# Altium schematic sheet IMU.SchDoc
size A; SheetNumber: 2; SheetTotal: 3
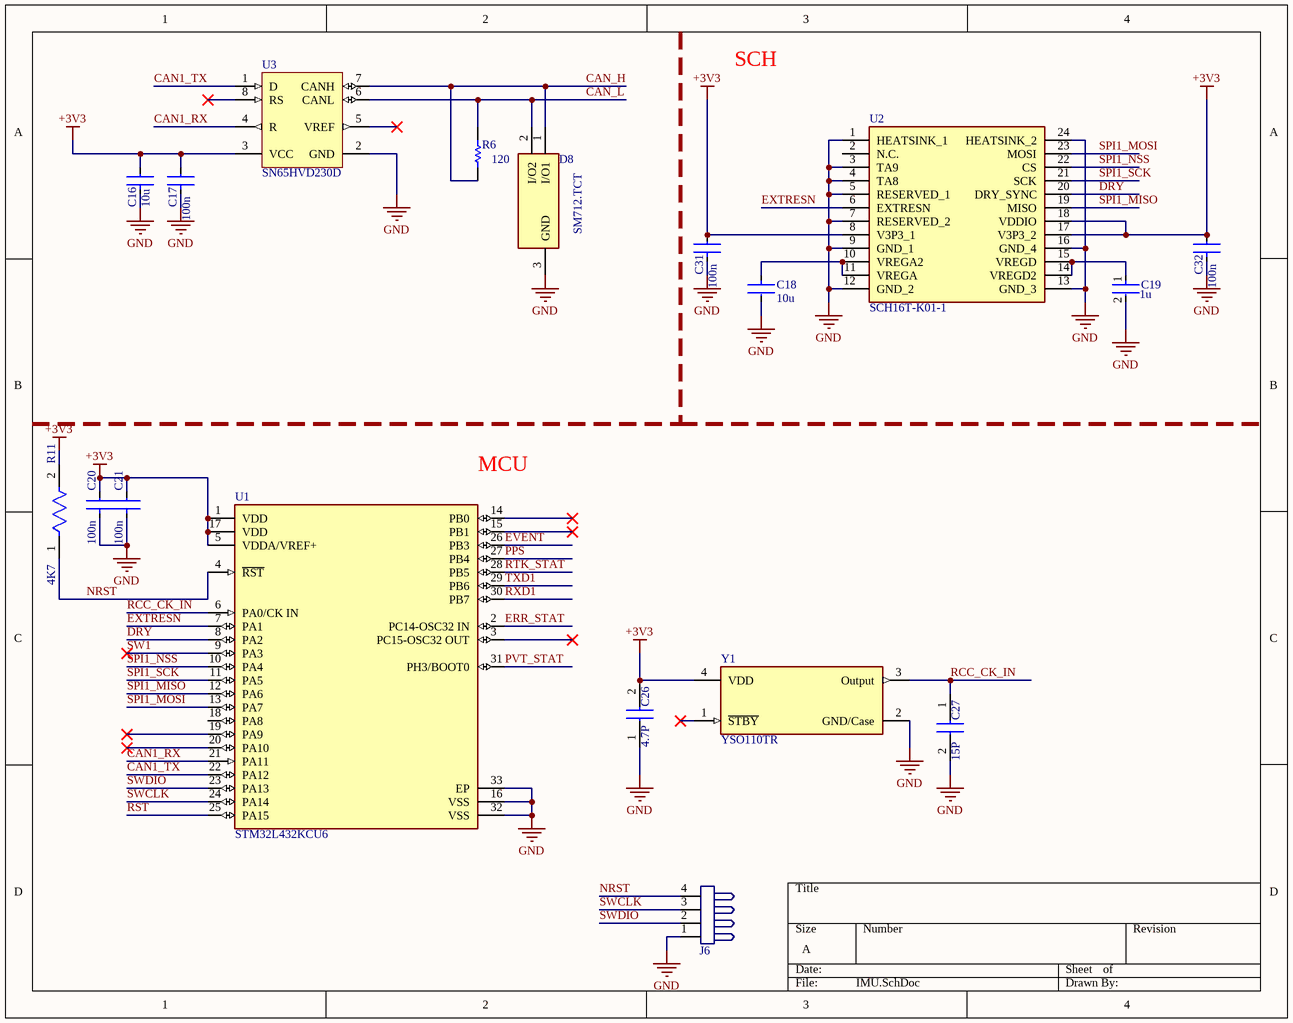
[diagram p0: IMU.SchDoc]

## Parts
C16  value 10u  [FP-C1608-080-IPC_A]  (hidden comment: C1608X5R1E106M080AC)
C17  value 100n  [FP-C1005-050-0_05-IPC_C]  (hidden comment: C1005X7R1H104K050BB)
C18  value 10u  [FP-C1608-080-IPC_A]  (hidden comment: C1608X5R1E106M080AC)
C19  Capacitance: 1u  [FP-C1005-050-0_05-IPC_C]  (hidden comment: C1005X5R1V105K050BC)
C20  value 100n  [FP-C1005-050-0_05-IPC_C]  (hidden comment: C1005X7R1H104K050BB)
C21  value 100n  [FP-C1005-050-0_05-IPC_C]  (hidden comment: C1005X7R1H104K050BB)
C26  value 4.7P  [CAPC1005X55N]  (hidden comment: CC0402BRNPO9BN4R7)
C27  value 15P  [CAPC1005X55N]  (hidden comment: CC0402JRNPO8BN150)
C31  value 100n  [FP-C1005-050-0_05-IPC_C]  (hidden comment: C1005X7R1H104K050BB)
C32  value 100n  [FP-C1005-050-0_05-IPC_C]  (hidden comment: C1005X7R1H104K050BB)
D8  SM712.TCT  [SOT95P237X112-3N]
J6  PHDR 4  [PHDR2X2]  (value not drawn)
R6  value 120  [RESC1005X40X25NL05T10]  (hidden comment: RC0402FR-07120RL)
R11  value 4K7  [FP-RC0402-0_4-MFG]  (hidden comment: RC0402JR-074K7L)
U1  STM32L432KCU6  [FP-UFQFPN32-A0B8-MFG]
U2  SCH16T-K01-1  [SCH16TK011]
U3  SN65HVD230D  [D0008A_M]
Y1  YSO110TR  [FP-ASE-MFG]

## Nets
+3V3: C16.2 C17.2 C20.2 C21.2 C26.2 C31.2 C32.2 R11.2 U1.1(VDD) U1.5(VDDA/VREF+) U1.17(VDD) U2.8(V3P3_1) U2.17(V3P3_2) U2.18(VDDIO) U3.3(VCC) Y1.4(VDD)
GND: C16.1 C17.1 C18.2 C19.2 C20.1 C21.1 C26.1 C27.2 C31.1 C32.1 D8.3(GND) J6.1 U1.16(VSS) U1.32(VSS) U1.33(EP) U2.1(HEATSINK_1) U2.3(TA9) U2.4(TA8) U2.5(RESERVED_1) U2.7(RESERVED_2) U2.9(GND_1) U2.12(GND_2) U2.13(GND_3) U2.16(GND_4) U2.24(HEATSINK_2) U3.2(GND) Y1.2(GND/Case)
CAN1_RX: U1.21(PA11) U3.4(R)
CAN1_TX: U1.22(PA12) U3.1(D)
CAN_H: D8.1(I/O1) R6.1 U3.7(CANH)
CAN_L: D8.2(I/O2) R6.2 U3.6(CANL)
DRY: U1.8(PA2) U2.20(DRY_SYNC)
ERR_STAT: U1.2(PC14-OSC32_IN)
EVENT: U1.26(PB3)
EXTRESN: U1.7(PA1) U2.6(EXTRESN)
NRST: J6.4 R11.1 U1.4(~{RST})
PPS: U1.27(PB4)
PVT_STAT: U1.31(PH3/BOOT0)
RCC_CK_IN: C27.1 U1.6(PA0/CK_IN) Y1.3(Output)
RST: U1.25(PA15)
RTK_STAT: U1.28(PB5)
RXD1: U1.30(PB7)
SPI1_MISO: U1.12(PA6) U2.19(MISO)
SPI1_MOSI: U1.13(PA7) U2.23(MOSI)
SPI1_NSS: U1.10(PA4) U2.22(CS)
SPI1_SCK: U1.11(PA5) U2.21(SCK)
SW1: U1.9(PA3)
SWCLK: J6.3 U1.24(PA14)
SWDIO: J6.2 U1.23(PA13)
TXD1: U1.29(PB6)
NetC18_1: C18.1 U2.10(VREGA2) U2.11(VREGA)
NetC19_1: C19.1 U2.14(VREGD2) U2.15(VREGD)

Not connected (* = marked no-connect by the designer): U1 3(PC15-OSC32_OUT)* 14(PB0)* 15(PB1)* 18(PA8) 19(PA9)* 20(PA10)*; U2 2(N.C.); U3 5(VREF)* 8(RS)*; Y1 1(~{STBY})*

## Notes on the sheet
- SCH
- (near U1) MCU

## Library data of the parts
C16 C18 = CMP-2000-05442-2: CAP CER 10UF 25V X5R 0603; Dielectric Material: Ceramic; Tolerance: 20%; Dielectric: X5R; Length: 1.6mm; Termination: SMD/SMT; Depth: 0.8mm; RoHS Compliant: Yes; Construction: Flat; Weight: 7.1E-05oz; Thickness: 0.039inch; Packaging: Tape and Reel; Min Operating Temperature: -55°C; Case Code (Imperial): 0603; Case/Package: 0603; Height: 0.8mm; Case Code (Metric): 1608; Voltage Rating: 25V; Resistor Type: Ceramic; Voltage Rating (DC): 25V; Max Operating Temperature: 85°C; REACH SVHC: No SVHC; Lead Free: Lead Free; Series: C; Width: 0.8mm; Mount: Surface Mount; Package Quantity: 1; Capacitance: 10uF
C17 C20 C21 C31 C32 = CMP-2000-05393-2: Multilayer Ceramic Capacitors 100nF ±10% 50V X7R SMD 0402; Voltage: 50V; Dielectric Material: Ceramic; Min Operating Temperature: -55°C; Depth: 0.5mm; Radiation Hardening: No; RoHS Compliant: Yes; Voltage Rating (DC): 50V; Lead Free: Lead Free; Resistor Type: Ceramic; Height: 0.5mm; Dielectric: X7R; Thickness: 0.022inch; Case/Package: 0402; Case Code (Metric): 1005; Termination: SMD/SMT; Capacitance: 100nF; Packaging: Tape and Reel; Max Operating Temperature: 125°C; Mount: Surface Mount; Package Quantity: 1; Width: 0.02inch; Weight: 2.3E-05oz; Voltage Rating: 50V; Tolerance: 10%; Construction: Flat; Case Code (Imperial): 0402; Length: 1mm; REACH SVHC: No SVHC; Series: C
C19 = CMP-2000-06004-2: Multilayer Ceramic Capacitors 1μF ±10% 35V X5R SMD 0402; Series: C; Voltage Rating (DC): 35V; Max Operating Temperature: 85°C; Resistor Type: Ceramic; REACH SVHC: No SVHC; Package Quantity: 1; Packaging: Tape and Reel; Termination: SMD/SMT; Dielectric Material: Ceramic; Height: 0.5mm; Length: 1mm; Min Operating Temperature: -55°C; Dielectric: X5R; Thickness: 0.022inch; Lead Free: Lead Free; Voltage Rating: 35V; Width: 0.02inch; Depth: 0.5mm; Case Code (Imperial): 0402; Case/Package: 0402; Tolerance: 10%; Weight: 2.3E-05oz; Radiation Hardening: No; RoHS Compliant: Yes; Case Code (Metric): 1005; Mount: Surface Mount
C26 = CC0402BRNPO9BN4R7: Capacitor; Manufacturer_Name: KEMET; Datasheet Link: https://4donline.ihs.com/images/VipMasterIC/IC/YAGO/YAGO-S-A0009251638/YAGO-S-A0009251638-1.pdf?hkey=6D3A4C79FDBF58556ACFDE234799DDF0; Height: 0.55mm; Manufacturer_Part_Number: CC0402BRNPO9BN4R7; Mouser Part Number: 603-CC402BRNPO9BN4R7; Mouser Price/Stock: https://www.mouser.co.uk/ProductDetail/Yageo/CC0402BRNPO9BN4R7?qs=AgBp2OyFlx%2FGrCNlQaiLcg%3D%3D; Arrow Part Number: CC0402BRNPO9BN4R7; Arrow Price/Stock: https://www.arrow.com/en/products/cc0402brnpo9bn4r7/yageo
C27 = CC0402JRNPO8BN150: Capacitor; Manufacturer_Name: KEMET; Datasheet Link: https://www.mouser.com/datasheet/2/447/UPY-GP_NP0_16V-to-50V_16-1109089.pdf; Height: 0.55mm; Manufacturer_Part_Number: CC0402JRNPO8BN150; Mouser Part Number: 603-CC402JRNPO8BN150; Mouser Price/Stock: https://www.mouser.com/Search/Refine.aspx?Keyword=603-CC402JRNPO8BN150; Arrow Part Number: CC0402JRNPO8BN150; Arrow Price/Stock: https://www.arrow.com/en/products/cc0402jrnpo8bn150/yageo
D8 = SM712.TCT: Diode; Manufacturer_Name: SEMTECH; Datasheet Link: https://datasheet.datasheetarchive.com/originals/distributors/Datasheets-30/DSA-588511.pdf; Height: 1.12mm; Manufacturer_Part_Number: SM712.TCT; Mouser Part Number: 947-SM712.TCT; Mouser Price/Stock: https://www.mouser.co.uk/ProductDetail/Semtech/SM712.TCT?qs=rBWM4%252BvDhIfYU4k7Soov1w%3D%3D; Arrow Part Number: SM712.TCT; Arrow Price/Stock: https://www.arrow.com/en/products/sm712.tct/semtech?utm_currency=USD&region=nac
J6 = PHDR 4: PinHeader
R6 = CMP-2002-07370-1: Manufacturer: Yageo / Phycomp; Part Number: RC0402FR-07120RL
R11 = CMP-2002-08011-2: Tolerance: 5%; Power Rating: 63mW; Voltage Rating: 50V; Temperature Coefficient: 100ppm/°C; Composition: Thick Film; Max Operating Temperature: 155°C; Case/Package: 0402; Depth: 500µm; Packaging: Tape & Reel; Number of Pins: 2; Schedule B: 8533210045, 8533210045; Case Code (Imperial): 0402; Termination: SMD/SMT; Military Standard: Not; Lead Free: Lead Free; Width: 500µm; REACH SVHC: No SVHC; Max Power Dissipation: 63mW; Voltage Rating (AC): 50V; Features: Moisture Resistant; Min Operating Temperature: -55°C; Number of Terminations: 2; RoHS: Compliant; Height: 350µm; Voltage Rating (DC): 50V; Length: 1mm
U1 = CMP-12105-000033-1: IC MCU 32BIT 256KB FLASH 32QFPN; Manufacturer: STMicroelectronics; Max Supply Voltage: 3.6V; Number Of Timers/Counters: 11; Ram Size: 64KBytes; Number Of Usb Channels: 1; Memory Size: 256KBytes; Number Of Uart Channels: 3; Frequency: 80MHz; Number Of I2C Channels: 2; Core Architecture: ARM Cortex-M4; Number Of I/Os: 26; Min Supply Voltage: 1.62V; Data Bus Width: 32bits; Max Junction Temp: +105°C; Interface: I2C,SPI,UART,USART,CAN,USB,LIN,IrDA,Other; Ambient Temperature Range High: +85°C; Category: IC; Device Class L2: Embedded Processors and Controllers; Ambient Temperature Range Low: -40°C; Number Of Adc Channels: 11; ComponentLink2Description: Datasheet; Number Of A/D Converters: 1; Device Class L1: Integrated Circuits (ICs); Memory Type: FLASH; Height: 0.6mm; Temperature: -40°C to +105°C; Automotive: No; Temperature Range Low: -40°C; Digikey Description: IC MCU 32BIT 256KB FLASH 32QFPN; Manufacturer Part Number: STM32L432KCU6; Temperature Range High: +105°C; Octopart: https://octopart.com/stm32l432kcu6-stmicroelectronics-71093510; Device Class L3: Microcontrollers; Number Of Pwm Channels: 1; Number Of Spi Channels: 2; Lead Free: Yes; Number Of Cores: 1; Package: UFQFPN32-A0B8; ComponentLink2URL: https://www.st.com/content/ccc/resource/technical/document/datasheet/24/01/9f/59/f0/83/47/fc/DM00257205.pdf/files/DM00257205.pdf/jcr:content/translations/en.DM00257205.pdf; RoHS: TRUE
U2 = SCH16T-K01-1: Undefined or Miscellaneous; Manufacturer_Name: Murata Electronics; Datasheet Link: https://www.murata.com/-/media/webrenewal/products/sensor/pdf/datasheet/datasheet-sch16t-series-short.ashx?la=en-us&cvid=20240110024121000000; Height: 3mm; Manufacturer_Part_Number: SCH16T-K01-1; Mouser Part Number: 81-SCH16T-K01-1; Mouser Price/Stock: https://www.mouser.co.uk/ProductDetail/Murata-Electronics/SCH16T-K01-1?qs=HFfMDpzxxd0hctvcENbFhg%3D%3D; Arrow Part Number: SCH16T-K01-1; Arrow Price/Stock: https://www.arrow.com/en/products/sch16t-k01-1/murata-manufacturing?utm_currency=USD&region=nac
U3 = CMP-0315-00046-3: CAN Bus Transceiver, 3.3 V, -40 to 85 degC, 8-Pin SOIC (D), Green (RoHS & no Sb/Br), Tube; Supply Voltage Min: 3 V; Supply Voltage Max: 3.6 V; PartNumber: SN65HVD230D; ComponentLink2URL: http://www.ti.com/general/docs/lit/getliterature.tsp?genericGeneric Part Number=SN65HVD230&fileType=pdf; DatasheetVersion: SLOS346N; Generic Part Number: SN65HVD230; Packing: Tube; Temperature Min: -40 degC; Temperature Max: 85 degC; ComponentLink1Description: Manufacturer URL; Mounting Technology: Surface Mount; RoHS: TRUE; ComponentLink1URL: http://www.ti.com/; ComponentLink2Description: Datasheet; PackageDescription: 8-Pin Plastic Small Outline, Body 4.9 x 3.9 mm, Pitch 1.27 mm
Y1 = CMP-27762-009764-1: XTAL Oscillator 50MHz ±50ppm CMOS 3.3V 4-SMD 3.2mm x 2.5mm; Load Capacitance: 15pF; Max Supply Current: 19mA; Min Supply Voltage: 3.135V; Max Supply Voltage: 3.465V; Packaging: Tape and Reel; Height: 0.047inch; Mount: Surface Mount; Frequency Stability: 50ppm; Lead Free: Lead Free; Number of Pins: 4; Width: 0.098inch; Radiation Hardening: No; Max Operating Temperature: 85°C; Length: 3.2mm; REACH SVHC: No SVHC; Series: ASE; Depth: 2.5mm; Operating Supply Voltage: 3.3V; Min Operating Temperature: -40°C; Package Quantity: 1000; Operating Frequency: 50 MHz; Case/Package: SMD/SMT; Termination: SMD/SMT; Frequency: 50MHz